# EAGLE design TEC_controller_v1.0 (EAGLE 7.2.0)
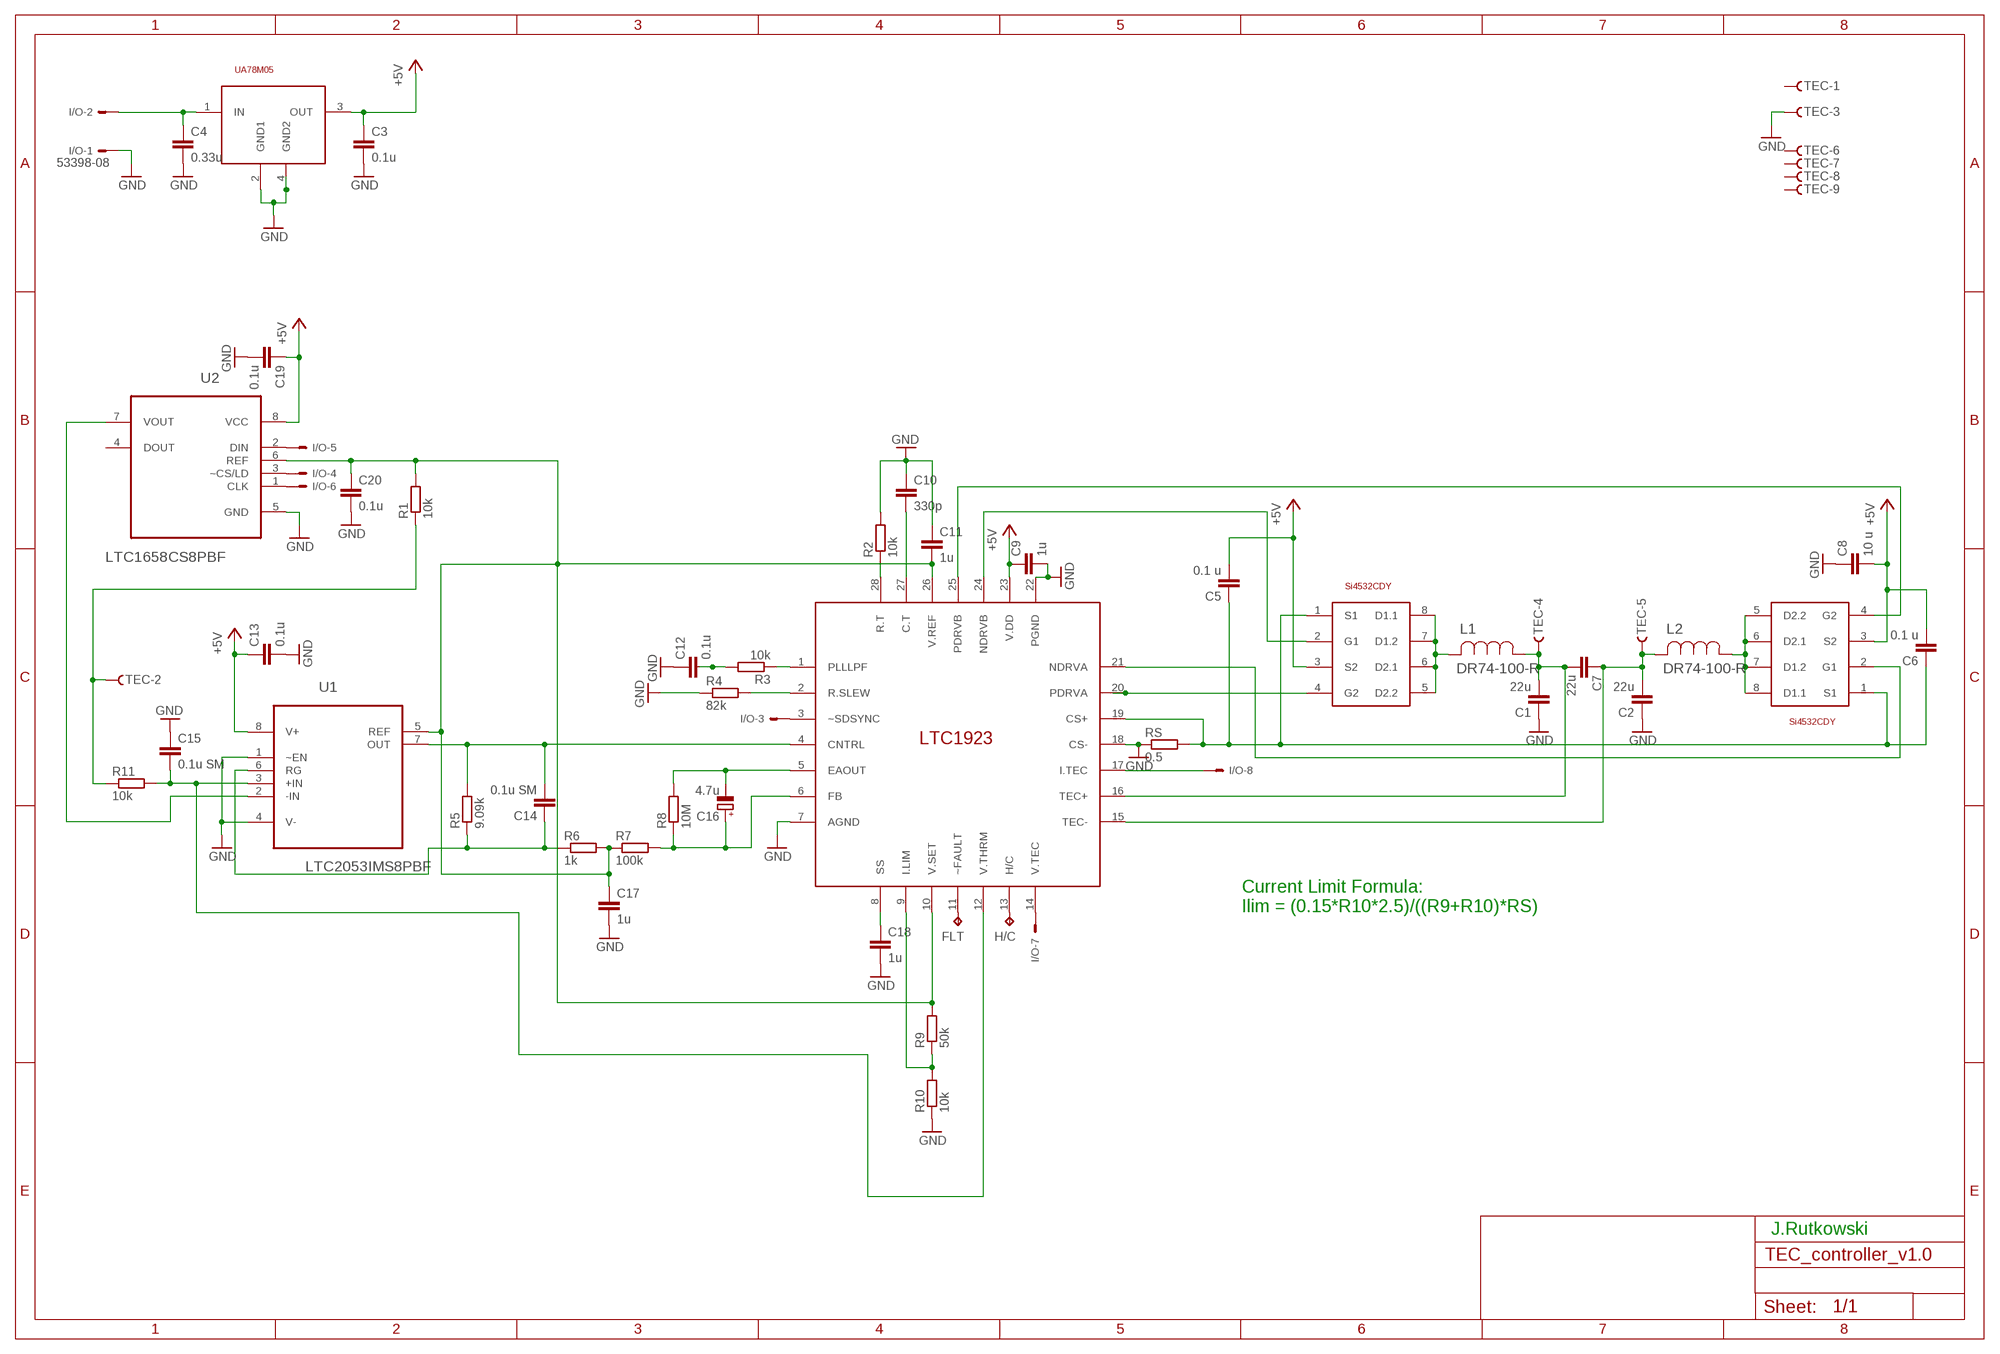
[diagram p0: schematic, sheet 1]

## Parts
C1  22u  C-EUC1210K  [C1210K]
C2  22u  C-EUC1210K  [C1210K]
C3  0.1u  C-EUC0805K  [C0805K]
C4  0.33u  C-EUC0805K  [C0805K]
C5  0.1 u  C-EUC0805K  [C0805K]
C6  0.1 u  C-EUC0805K  [C0805K]
C7  22u  C-EUC1210K  [C1210K]
C8  10 u  C-EUC1206K  [C1206K]
C9  1u  C-EUC0603K  [C0603K]
C10  330p  C-EUC0603K  [C0603K]
C11  1u  C-EUC0603K  [C0603K]
C12  0.1u  C-EUC0603K  [C0603K]
C13  0.1u  C-EUC0603  [C0603]
C14  0.1u SM  C-EUC1210  [C1210]
C15  0.1u SM  C-EUC1210  [C1210]
C16  4.7u  CPOL-EUA/3216-18W  [A/3216-18W]
C17  1u  C-EUC0603K  [C0603K]
C18  1u  C-EUC0603K  [C0603K]
C19  0.1u  C-EUC0603K  [C0603K]
C20  0.1u  C-EUC0603K  [C0603K]
FLT  TPTP17SQ  [TP17SQ]
H/C  TPTP17SQ  [TP17SQ]
I/O  53398-08  [53398-08]
L1  DR74-100-R  [INDM7676X435N]
L2  DR74-100-R  [INDM7676X435N]
R1  10k  R-EU_R0603  [R0603]
R2  10k  R-EU_R0603  [R0603]
R3  10k  R-EU_R0603  [R0603]
R4  82k  R-EU_R0603  [R0603]
R5  9.09k  R-EU_R0603  [R0603]
R6  1k  R-EU_R0603  [R0603]
R7  100k  R-EU_R0603  [R0603]
R8  10M  R-EU_R0603  [R0603]
R9  50k  R-EU_R0603  [R0603]
R10  10k  R-EU_R0603  [R0603]
R11  10k  R-EU_R0603  [R0603]
RS  0.5  R-EU_R1206  [R1206]
TEC  F09HPS  [F09HP]
U1  LTC2053IMS8PBF  [SOP65P490X110-8N]
U2  LTC1658CS8PBF  [SOIC127P600X175-8N]
U$1  LTC1923  [SSOP28]
U$2  SI4532CDY  [SOIC127P600X175-8N]
U$3  SI4532CDY  [SOIC127P600X175-8N]
U$6  UA78M05  [SOT-223]

## Nets
+5V: C3.1 C5.2 C6.2 C8.2 C9.1 C13.1 C19.1 U1.8(V+) U2.8(VCC) U$1.23(V.DD) U$2.3(S2) U$3.3(S2) U$6.3(OUT)
GND: C1.1 C2.1 C3.2 C4.2 C8.1 C9.2 C10.1 C11.1 C12.1 C13.2 C15.1 C17.2 C18.2 C19.2 C20.2 I/O.1 R2.2 R4.1 R10.1 RS.1 TEC.3 U1.1(~EN) U1.4(V-) U2.5(GND) U$1.7(AGND) U$1.18(CS-) U$1.22(PGND) U$6.2(GND1) U$6.4(GND2)
N$1: U$1.20(PDRVA) U$2.4(G2)
N$2: C4.1 I/O.2 U$6.1(IN)
N$3: U$1.24(NDRVB) U$2.2(G1)
N$4: L1.2 U$2.5(D2.2) U$2.6(D2.1) U$2.7(D1.2) U$2.8(D1.1)
N$5: C1.2 C7.2 L1.1 TEC.4 U$1.16(TEC+)
N$6: L2.1 U$3.5(D2.2) U$3.6(D2.1) U$3.7(D1.2) U$3.8(D1.1)
N$7: C5.1 C6.1 RS.2 U$1.19(CS+) U$2.1(S1) U$3.1(S1)
N$8: U$1.21(NDRVA) U$3.2(G1)
N$9: C2.2 C7.1 L2.2 TEC.5 U$1.15(TEC-)
N$10: U$1.25(PDRVB) U$3.4(G2)
N$11: I/O.4 U2.3(~CS/LD)
N$12: R2.1 U$1.28(R.T)
N$13: I/O.8 U$1.17(I.TEC)
N$14: C10.2 U$1.27(C.T)
N$15: I/O.7 U$1.14(V.TEC)
N$16: I/O.3 U$1.3(~SDSYNC)
N$17: I/O.5 U2.2(DIN)
N$19: I/O.6 U2.1(CLK)
N$20: H/C.TP U$1.13(H/C)
N$21: R3.1 U$1.1(PLLLPF)
N$22: C12.2 R3.2
N$23: R4.2 U$1.2(R.SLEW)
N$24: C14.2 R5.2 U1.7(OUT) U$1.4(CNTRL)
N$25: C14.1 R5.1 R6.1 U1.6(RG)
N$26: FLT.TP U$1.11(~FAULT)
N$27: C18.1 U$1.8(SS)
N$28: C15.2 R11.2 U1.3(+IN) U$1.12(V.THRM)
N$29: C16.+ R7.2 R8.1 U$1.6(FB)
N$30: C16.- R8.2 U$1.5(EAOUT)
N$31: R9.1 R10.2 U$1.9(I.LIM)
N$32: R1.1 R11.1 TEC.2
N$33: U1.2(-IN) U2.7(VOUT)
N$34: C11.2 C17.1 C20.1 R1.2 R6.2 R7.1 R9.2 U1.5(REF) U2.6(REF) U$1.10(V.SET) U$1.26(V.REF)
Unconnected: TEC.1 TEC.6 TEC.7 TEC.8 TEC.9 U2.4(DOUT)

## Notes on the sheet
- Current Limit Formula:
  Ilim = (0.15*R10*2.5)/((R9+R10)*RS)
- J.Rutkowski

## Library data of the parts
C1-C15 C17-C20 = rcl:C-EU: CAPACITOR, European symbol
C16 = rcl:CPOL-EU: POLARIZED CAPACITOR, European symbol
FLT H/C = testpad:TP: Test pad
I/O = con-molex:53?-08: CONNECTOR wire to board 1.25 mm (.049 inch) pitch header; OC_FARNELL: 1125371; OC_NEWARK: unknown
L1 L2 = ind_coiltronics:DR74-100-R: POWER INDUCTOR; CURRENTRATING: 2.41A; INDUCTANCE: 10uH; MPN: DR74-100-R; OC_FARNELL: 1463480; OC_NEWARK: 29K6170; PACKAGE: SMD; SUPPLIER: COILTRONICS; TOLERANCE: 20%
R1-R11 RS = rcl:R-EU_: RESISTOR, European symbol
TEC = con-subd:F09?S: SUB-D; OC_FARNELL: unknown; OC_NEWARK: unknown
U1 = LTC_By_element14_Batch_1:LTC2053IMS8PBF: Precision, Rail-to-Rail,Zero-Drift, Resistor-Programmable Instrumentation Amplifier; MPN: LTC2053IMS8#PBF; OC_FARNELL: 1663681; OC_NEWARK: 56M4734; PACKAGE: MSOP-8; SUPPLIER: Linear Technology
U2 = LTC_By_element14_Batch_1:LTC1658CS8PBF: 14-Bit Rail-to-Rail Micropower DAC in MSOP; MPN: LTC1658CS8#PBF; OC_FARNELL: 1663655; OC_NEWARK: 56M2959; PACKAGE: SOIC-8; SUPPLIER: Linear Technology
U$1 = LinearTech:LTC1923: High Efficiency Thermoelectric Cooler Controller; MPN: LTC1923EGN#PBF; OC_RS: 786-9884
U$2 U$3 = Custom-parts:SI4532CDY: N- and P-Channel 30 V (D-S) Mosfet, Vishay Siliconx; MPN: SI4532CDY-T1-GE3; OC_FARNELL: 1779268
U$6 = Custom-parts:UA78M05

## Board
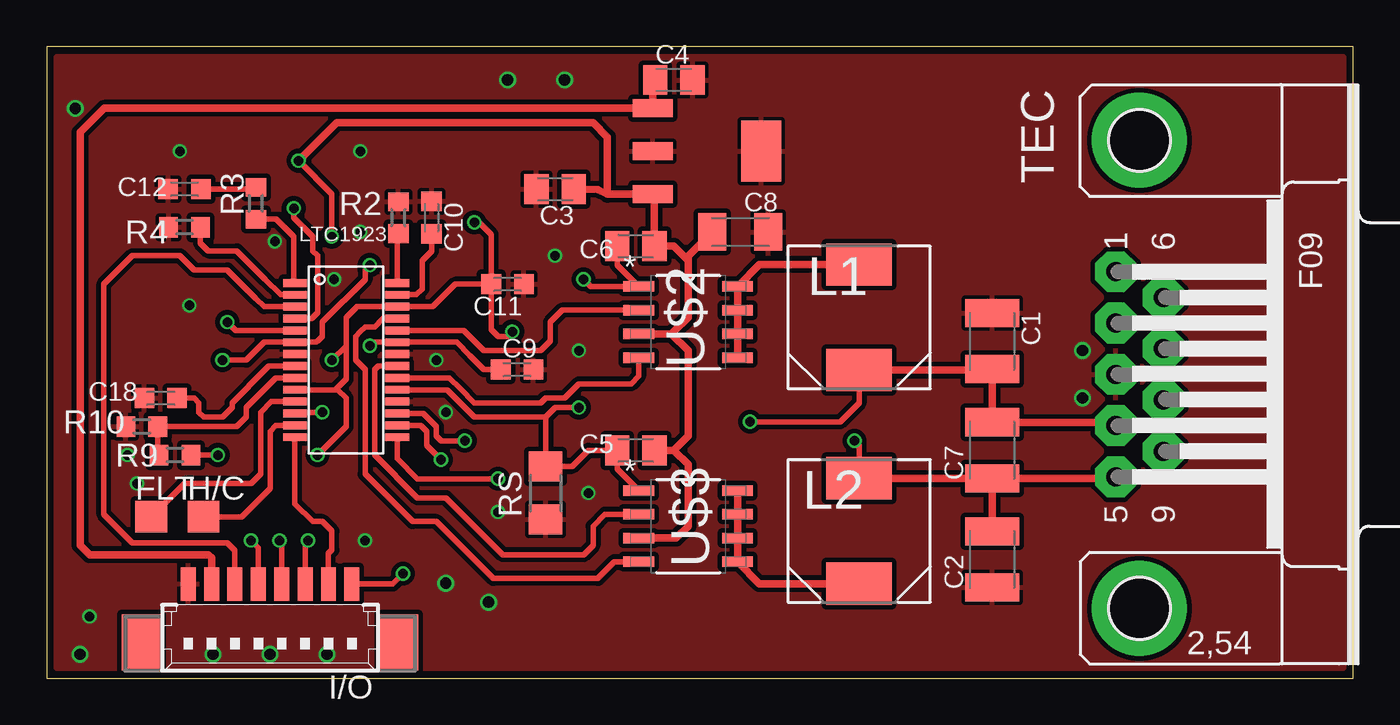
[diagram p1: board, top side]
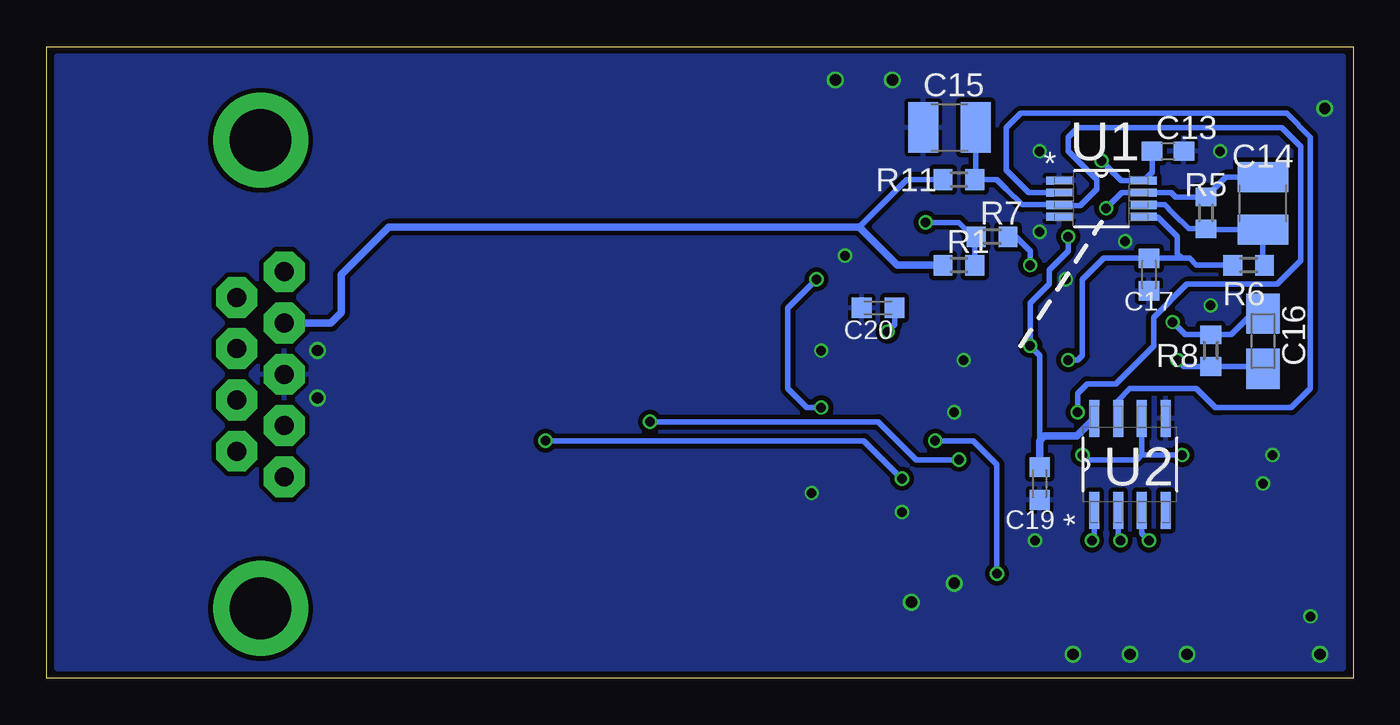
[diagram p2: board, bottom side, seen from below]

Size 69.85 x 33.78 mm. Coordinates in mm from the lower left corner, seen from the top.
Outline: 0,0 69.85,0 69.85,33.78 0,33.78 0,0
Copper layers (1*16): Top 0.018mm / dielectric 1.55mm / Bottom 0.018mm
Design rules "eC_2Layer_PClass6_BaseCopperO18_eCDefault *": minimum track width 0.15mm, minimum drill 0.35mm, track to track 0.15mm, track to pad 0.15mm, pad to pad 0.15mm, via to via 0.15mm, smd to smd 0mil, copper to edge 0.25mm, drill to drill 0.35mm, minimum pad ring 0.175mm, minimum via ring 0.125mm, stop-mask expansion 0mil, vias tented up to drill 0.45mm, thermal gap 0.2mm

### Footprints (pad centres in the part's own frame; a part is rotated, then mirrored left to right if it is on the bottom)
C1210K = smd 1.5 x 2.9: 1 -1.5,0; 2 1.5,0
C0805K = smd 1.3 x 1.6: 1 -1,0; 2 1,0
C1206K = smd 1.5 x 2: 1 -1.5,0; 2 1.5,0
C0603K = smd 1.05 x 1.08: 1 -0.875,0; 2 0.875,0
C0603 = smd 1.1 x 1: 1 -0.85,0; 2 0.85,0
C1210 = smd 1.6 x 2.7: 1 -1.4,0; 2 1.4,0
A/3216-18W = smd 2.15 x 1.8: + 1.475,0; - -1.475,0
TP17SQ = smd 1.7 x 1.7: TP 0,0
53398-08 = smd 0.8 x 1.8: 1 4.375,-2.5; 2 3.125,-2.5; 3 1.875,-2.5; 4 0.625,-2.5; 5 -0.625,-2.5; 6 -1.875,-2.5; 7 -3.125,-2.5; 8 -4.375,-2.5 | smd 2.1 x 3: S1 6.875,0.625; S2 -6.875,0.625
INDM7676X435N = smd 2.261 x 3.505: 1 -2.819,0; 2 2.819,0
R0603 = smd 1 x 1.1: 1 -0.85,0; 2 0.85,0
R1206 = smd 1.6 x 1.803: 1 -1.422,0; 2 1.422,0
F09HP = drill 1.016 pad 2.184 octagon: 1 -5.486,-1.27; 2 -2.743,-1.27; 3 0,-1.27; 4 2.743,-1.27; 5 5.486,-1.27; 6 -4.115,1.27; 7 -1.372,1.27; 8 1.372,1.27; 9 4.115,1.27 | drill 3.302 pad 5.08: G1 -12.522,0; G2 12.522,0
SOP65P490X110-8N = smd 1.397 x 0.432: 1 -2.261,0.965; 2 -2.261,0.33; 3 -2.261,-0.33; 4 -2.261,-0.965; 5 2.261,-0.965; 6 2.261,-0.33; 7 2.261,0.33; 8 2.261,0.965
SOIC127P600X175-8N = smd 1.981 x 0.533: 1 -2.464,1.905; 2 -2.464,0.635; 3 -2.464,-0.635; 4 -2.464,-1.905; 5 2.464,-1.905; 6 2.464,-0.635; 7 2.464,0.635; 8 2.464,1.905
SSOP28 = smd 0.419 x 1.27: 1 -4.128,-2.731; 2 -3.493,-2.731; 3 -2.857,-2.731; 4 -2.223,-2.731; 5 -1.587,-2.731; 6 -0.953,-2.731; 7 -0.318,-2.731; 8 0.318,-2.731; 9 0.953,-2.731; 10 1.587,-2.731; 11 2.223,-2.731; 12 2.857,-2.731; 13 3.493,-2.731; 14 4.128,-2.731; 15 4.128,2.731; 16 3.493,2.731; 17 2.857,2.731; 18 2.223,2.731; 19 1.587,2.731; 20 0.953,2.731; 21 0.318,2.731; 22 -0.318,2.731; 23 -0.953,2.731; 24 -1.587,2.731; 25 -2.223,2.731; 26 -2.857,2.731; 27 -3.493,2.731; 28 -4.128,2.731
SOIC127P600X175-8N' = smd 1.651 x 0.559: 1 -2.642,1.905; 2 -2.642,0.635; 3 -2.642,-0.635; 4 -2.642,-1.905; 5 2.642,-1.905; 6 2.642,-0.635; 7 2.642,0.635; 8 2.642,1.905
SOT-223 = smd 0.95 x 2.15: 1 -2.3,-2.9; 2 0,-2.9; 3 2.3,-2.9 | smd 3.25 x 2.15: 4 0,2.9

### Placement (x,y rotation side)
C1  50.55,18.03 270 top
C2  50.55,6.35 90 top
C3  27.18,26.16 180 top
C4  33.53,32 0 top
C5  31.5,12.19 0 top
C6  31.5,23.11 0 top
C7  50.55,12.19 90 top
C8  37.08,23.88 180 top
C9  25.15,16.51 0 top
C10  20.57,24.64 270 top
C11  24.64,21.08 180 top
C12  7.37,26.16 0 top
C13  9.91,28.19 0 bottom
C14  4.83,25.4 90 bottom
C15  21.59,29.46 0 bottom
C16  4.83,18.03 270 bottom
C17  10.92,21.59 270 bottom
C18  6.1,14.99 180 top
C19  16.76,10.41 270 bottom
C20  25.4,19.81 180 bottom
FLT  5.59,8.64 0 top
H/C  8.38,8.64 0 top
I/O  11.94,2.54 180 top
L1  43.43,19.3 90 top
L2  43.43,7.87 90 top
R1  21.08,22.1 0 bottom
R2  18.8,24.64 90 top
R3  11.18,25.4 90 top
R4  7.37,24.13 0 top
R5  7.87,24.89 90 bottom
R6  5.59,22.1 180 bottom
R7  19.3,23.62 0 bottom
R8  7.62,17.53 90 bottom
R9  6.86,11.94 0 top
R10  5.08,13.46 0 top
R11  21.08,26.67 0 bottom
RS  26.67,9.91 90 top
TEC  58.42,16.26 270 top
U1  13.46,25.65 0 bottom
U2  11.94,11.43 90 bottom
U$1  16,17.02 270 top
U$2  SI4532CDY  [SOIC127P600X175-8N']  34.29,19.05 0 top
U$3  SI4532CDY  [SOIC127P600X175-8N']  34.29,8.13 0 top
U$6  35.31,28.19 270 top

### Tracks (layer width: path | path; a pad name or v marks a point on that pad's centre or on a via)
+5V  (via drill 0.51)
  Top 0.305: v17.27,17.78 17.46,17.97 U$1.23 21.91,17.97 22.61,17.27 23.37,16.51 C9.1 | v15.24,23.62 15.24,25.91 v13.46,27.69
  Top 0.406: v13.46,27.69 15.51,29.73 29.11,29.72 29.21,29.72 29.97,28.96 29.97,25.89 | 34.29,22.35 33.53,23.11 C6.2 32.49,23.12 32.49,26.07 U$6.3 29.97,25.89 | 34.29,22.35 34.29,19.3 33.53,18.54 33.4,18.41 | U$2.3 33.4,18.41 | C5.2 33.53,12.19 | 33.53,12.19 34.29,12.95 34.29,17.53 33.4,18.41 | U$3.3 33.66,7.49 34.29,8.13 34.29,11.43 33.53,12.19 | 29.97,25.89 29.46,26.15 C3.1 | 34.29,22.35 34.29,22.58 C8.2
  Bottom 0.305: C13.1 10.76,27.07 U1.8 12.39,26.62 v13.46,27.69 | C19.1 16.76,17.27 v17.27,17.78 17.27,20.07 16.76,20.57 16.26,21.08 16.26,21.84 15.75,22.35 15.24,22.86 v15.24,23.62
  Bottom 0.406: C19.1 16.76,12.7 16.51,12.95 14.78,12.95 U2.8
GND  (via drill 0.51, 0.6)
  other vias: 15.37,21.34 7.62,19.94 12.19,23.37 2.29,3.3 4.83,10.41 4.32,11.94 16.76,28.19 16.76,23.88 7.11,28.19 27.18,22.61 28.45,17.53 24.13,8.89 28.96,9.91 21.34,14.22 20.83,17.02 17.02,7.37 1.52,30.48 8.89,1.27 14.99,1.27 21.34,5.08 23.62,4.06 27.69,32 11.94,1.27 1.78,1.27 24.64,32 55.37,17.53 55.37,14.99
  pour Top (isolate 0.254): 0.51,33.27 69.34,33.27 69.34,0.51 0.51,0.51
  pour Bottom (isolate 0.254): 0.51,33.27 69.34,33.27 69.34,0.51 0.51,0.51
N$1
  Top 0.305: U$2.4 31.65,16.15 31.24,15.75 28.45,15.75 27.69,14.99 26.67,14.99 26.42,14.73 22.86,14.73 22.1,15.49 21.53,16.07 U$1.20
N$2
  Top 0.406: C4.1 32.41,32.39 U$6.1 3.06,30.49 1.78,29.21 1.78,7.11 2.29,6.6 8.64,6.6 8.81,6.43 I/O.2
N$3
  Top 0.305: U$1.24 22.29,18.61 23.37,17.53 26.42,17.53 26.92,18.03 26.92,19.05 27.56,19.68 U$2.2
N$4
  Top 0.406: U$2.5 U$2.6 U$2.7 U$2.8 38.1,22.12 L1.2
N$5  (via drill 0.51)
  Top 0.305: L1.1 43.43,14.73 42.42,13.72 v37.59,13.72 | v21.08,11.68 20.32,12.45 20.32,13.21 20,13.53 U$1.16
  Top 0.406: TEC.4 56.97,13.69 C7.2 C1.2 50.5,16.48 L1.1
  Bottom 0.305: v37.59,13.72 25.4,13.72 23.37,11.68 v21.08,11.68
N$6
  Top 0.406: U$3.8 U$3.7 U$3.6 U$3.5 38.1,5.05 L2.1
N$7  (via drill 0.51)
  Top 0.305: 26.67,13.97 RS.2 28.09,11.33 28.96,12.19 C5.1 30.5,11.19 U$3.1 | C6.1 30.5,22.11 U$2.1 29.08,20.95 v28.7,21.34 | v28.45,14.48 27.18,14.48 26.67,13.97 | 26.67,13.97 22.86,13.97 21.84,14.99 21.4,15.43 U$1.19
  Bottom 0.305: v28.7,21.34 30.23,19.81 30.23,15.49 29.21,14.48 v28.45,14.48
N$8
  Top 0.305: U$3.2 29.84,8.76 29.21,8.13 29.21,7.11 28.7,6.6 24.38,6.6 21.34,9.65 19.81,9.65 17.53,11.94 17.53,16.51 17.72,16.7 U$1.21
N$9  (via drill 0.51)
  Top 0.305: L2.2 43.43,12.45 v43.18,12.7 | v24.13,10.67 19.81,10.67 18.73,11.75 U$1.15
  Top 0.406: C7.1 57.07,10.69 TEC.5 | C2.2 C7.1 | L2.2 C7.1
  Bottom 0.305: v43.18,12.7 26.16,12.7 v24.13,10.67
N$10
  Top 0.305: U$3.4 30.35,6.22 29.46,5.33 23.88,5.33 21.08,8.13 20.83,8.38 19.56,8.38 17.02,10.92 17.02,16.51 16.51,17.02 16.51,17.27 16.51,18.29 16.76,18.54 17.02,18.8 17.53,18.8 17.97,19.24 U$1.25
N$11  (via drill 0.51)
  Top 0.305: I/O.4 11.31,6.97 v10.92,7.37
  Bottom 0.305: U2.3 11.3,7.75 v10.92,7.37
N$12
  Top 0.305: U$1.28 18.73,23.72 R2.1
N$13  (via drill 0.51)
  Top 0.305: I/O.8 18.5,5.04 v19.05,5.59 | U$1.17 20.13,14.16 20.83,13.46 20.83,12.95 21.08,12.7 v22.35,12.7
  Bottom 0.305: v22.35,12.7 20.32,12.7 19.05,11.43 v19.05,5.59
N$14
  Top 0.305: U$1.27 19.75,20.51 20.07,20.83 20.07,22.35 20.57,22.86 C10.2
N$15
  Top 0.305: I/O.7 15.06,6.68 15.24,6.86 15.24,7.87 14.99,8.13 14.73,8.38 14.22,8.38 13.27,9.34 U$1.14
N$16
  Top 0.305: I/O.3 10.06,6.83 9.65,7.24 4.57,7.24 3.05,8.76 3.05,21.08 4.57,22.61 7.11,22.61 7.87,21.84 9.65,21.84 11.18,20.32 11.62,19.88 U$1.3
N$17  (via drill 0.51)
  Top 0.305: I/O.5 12.56,7.25 v12.45,7.37
  Bottom 0.305: U2.2 12.57,7.49 v12.45,7.37
N$19  (via drill 0.51)
  Top 0.305: I/O.6 13.81,7.21 v13.97,7.37
  Bottom 0.305: U2.1 13.84,7.49 v13.97,7.37
N$20
  Top 0.305: U$1.13 12.26,13.53 11.94,13.21 11.94,10.16 10.41,8.64 H/C.TP
N$21
  Top 0.305: R3.1 12.28,24.55 13.21,23.62 13.21,21.21 U$1.1
N$22
  Top 0.305: C12.2 11.09,26.16 R3.2
N$23
  Top 0.305: R4.2 8.22,23.28 8.64,22.86 10.16,22.86 11.68,21.34 12.51,20.51 U$1.2
N$24  (via drill 0.51)
  Top 0.305: U$1.4 14.16,19.24 14.48,19.56 14.48,22.61 14.22,22.86 14.22,23.62 13.21,24.64 v13.21,25.15
  Bottom 0.305: C14.2 6.82,26.8 R5.2 9.49,25.74 9.65,25.91 9.73,25.98 U1.7 12.37,25.98 12.45,25.91 12.95,25.4 v13.21,25.15
N$25
  Bottom 0.305: U1.6 10.08,25.32 9.65,24.89 8.8,24.04 R5.1 7.83,24 C14.1 4.83,22.19 R6.1
N$26
  Top 0.305: U$1.11 12,14.8 11.43,14.22 11.43,10.92 10.92,10.41 7.37,10.41 FLT.TP
N$27
  Top 0.305: C18.1 7.87,14.99 8.13,14.73 8.13,14.22 8.38,13.97 9.4,13.97 9.91,14.48 9.91,14.73 11.68,16.51 11.87,16.7 U$1.8
N$28  (via drill 0.51)
  Top 0.305: U$1.12 13.34,14.22 v14.73,14.22
  Bottom 0.305: C15.2 20.19,26.71 R11.2 19.05,26.67 18.54,26.16 17.7,25.32 U1.3 15.67,25.27 14.61,25.27 13.72,26.16 13.72,26.67 15.24,28.19 15.24,28.96 14.73,29.46 5.08,29.46 3.81,29.46 2.79,28.45 2.79,22.35 4.06,21.08 8.89,21.08 10.67,19.3 10.67,19.18 10.67,19.05 10.67,17.78 12.7,15.75 14.22,15.75 14.73,15.24 v14.73,14.22
N$29  (via drill 0.51)
  Top 0.305: 9.65,17.02 v9.4,17.02 10.67,17.02 11.62,17.97 U$1.6 14.41,17.97 14.48,18.03 14.73,18.29 14.73,19.05 17.02,21.34 17.02,21.84 v17.27,22.1
  Bottom 0.305: C16.+ 4.94,16.68 R8.1 9.06,16.68 v9.4,17.02 | R7.2 18.54,23.62 18.03,23.62 17.27,22.86 v17.27,22.1
N$30  (via drill 0.51)
  Top 0.305: 9.91,18.8 v9.65,19.05 10.1,18.61 U$1.5
  Bottom 0.305: 9.56,19.14 v9.65,19.05 8.98,18.38 R8.2 6.52,18.38 5.33,19.56 4.88,19.56 C16.-
N$31
  Top 0.305: U$1.9 12.26,16.07 10.67,14.48 10.67,13.97 10.16,13.46 R10.2 5.93,12.02 R9.1
N$32
  Bottom 0.305: R11.1 23.88,26.67 26.42,24.13
  Bottom 0.406: R1.1 24.38,22.1 26.42,24.13 51.56,24.13 54.1,21.59 54.1,19.56 54.66,19 TEC.2
N$33
  Bottom 0.305: U1.2 17.09,25.98 17.35,25.98 18.54,27.18 18.54,29.46 17.78,30.23 16.51,30.23 3.56,30.23 2.29,28.96 2.29,15.49 3.3,14.48 7.11,14.48 7.37,14.48 7.87,14.99 8.38,15.49 11.94,15.49 12.57,14.86 U2.7
N$34  (via drill 0.51)
  Top 0.305: C11.2 21.84,21.08 20.83,20.07 20.64,19.88 U$1.26 16.57,19.88 16.51,19.81 16,19.3 | 14.29,15.43 U$1.10 15.43,15.43 | 15.43,15.43 16,16 16,18.03 16,19.3 | v22.86,24.38 23.11,24.38 23.62,23.88 23.76,23.73 C11.2 | 24.64,18.29 v24.89,18.54 24.64,18.29 | C11.2 23.76,18.66 24.13,18.29 24.64,18.29 | v14.48,11.94 16,13.46 16,14.99 15.56,15.43 15.43,15.43 | 16,19.3 16,17.78 v15.24,17.02 | R9.2 v9.14,11.94
  Bottom 0.305: 9.14,22.46 C17.1 13.35,22.46 13.46,22.35 14.48,21.34 14.48,17.27 14.73,17.02 v15.24,17.02 | 9.14,22.46 8.75,22.46 8.38,22.1 R6.2 | U1.5 11.18,24.66 10.44,24.66 9.4,23.62 9.4,22.72 9.14,22.46 | U2.6 11.3,11.94 | 11.3,11.94 11.56,11.68 14.22,11.68 v14.48,11.94 | v22.86,24.38 21.08,24.38 20.23,23.53 | C20.1 24.52,18.91 v24.89,18.54 | 11.3,11.94 9.91,11.94 v9.14,11.94 | 20.23,23.53 R1.2 | 20.23,23.53 20.15,23.53 R7.1

### Text on the board
Top_Leg: C4 | TEC Controller rev. 1.0 | 78M05 | C12 | R3 | C3 | R2 | C10 | R4 | C6 | C8 | C11 | 1 | L1 | C1 | C18 | C9 | R10 | C5 | Rs | C7 | R9 | 1 | H/C | L2 | FLT | C2 | I/O | 1 | FEMTO-ST 2016
101bmp: C15 | C13 | FEMTO-ST 2016 | 1 | R11 | R5 | R7 | C14 | U1 | R6 | C20 | C16 | C17 | R1 | R8 | C19 | DAC | 1 | Analog I/O: / 2. Therm + / 3. Therm GND / 4. TEC+ / 5. TEC- | TEC Controller rev. 1.0 | Digital I/O: / 1. GND / 2. VCC / 3. ~SDSYNC / 4. ~CS / 5. DIN / 6. CLK / 7. Vtec / 8. Itec